# EAGLE schematic PowerIn (EAGLE 9.3.0)
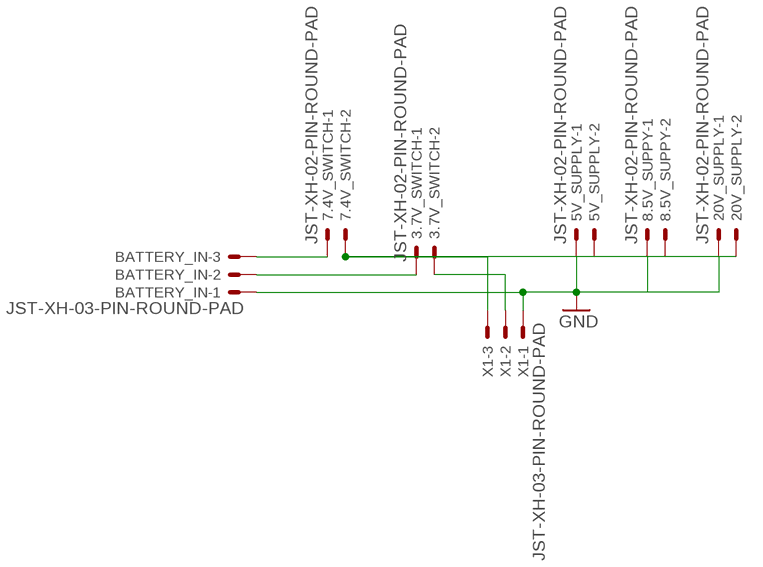
[diagram p0: schematic, sheet 1]

## Parts
3.7V_SWITCH  JST-XH-02-PIN-ROUND-PAD  [JST-XH-02-PACKAGE-ROUND-PAD]
5V_SUPPLY  JST-XH-02-PIN-ROUND-PAD  [JST-XH-02-PACKAGE-ROUND-PAD]
7.4V_SWITCH  JST-XH-02-PIN-ROUND-PAD  [JST-XH-02-PACKAGE-ROUND-PAD]
8.5V_SUPPY  JST-XH-02-PIN-ROUND-PAD  [JST-XH-02-PACKAGE-ROUND-PAD]
20V_SUPPLY  JST-XH-02-PIN-ROUND-PAD  [JST-XH-02-PACKAGE-ROUND-PAD]
BATTERY_IN  JST-XH-03-PIN-ROUND-PAD  [JST-XH-03-PACKAGE-ROUND-PAD]
X1  JST-XH-03-PIN-ROUND-PAD  [JST-XH-03-PACKAGE-ROUND-PAD]

## Nets
GND: 5V_SUPPLY.1 8.5V_SUPPY.1 20V_SUPPLY.1 BATTERY_IN.1 X1.1
N$1: 7.4V_SWITCH.1 BATTERY_IN.3
N$2: 3.7V_SWITCH.1 BATTERY_IN.2
N$4: 3.7V_SWITCH.2 X1.2
N$5: 5V_SUPPLY.2 7.4V_SWITCH.2 8.5V_SUPPY.2 20V_SUPPLY.2 X1.3

## Library data of the parts
3.7V_SWITCH 5V_SUPPLY 7.4V_SWITCH 8.5V_SUPPY 20V_SUPPLY = Rembrandt Electronics - JST XH Connectors v1-0:JST-XH-02-PIN: JST XH Connector 2 Pin Wire to board connector. Pitch: 2,54 mm, (0.100") Number of pins: 2 Created by Rembrandt Electronics www.rembrandtelectronics.com
BATTERY_IN X1 = Rembrandt Electronics - JST XH Connectors v1-0:JST-XH-03-PIN: JST XH Connector 2 Pin Wire to board connector. Pitch: 2,54 mm, (0.100") Number of pins: 3 Created by Rembrandt Electronics www.rembrandtelectronics.com

## Net classes
0 default: width 0.61 mm